# EAGLE design kinesisBLE V5 (EAGLE 9.5.2)
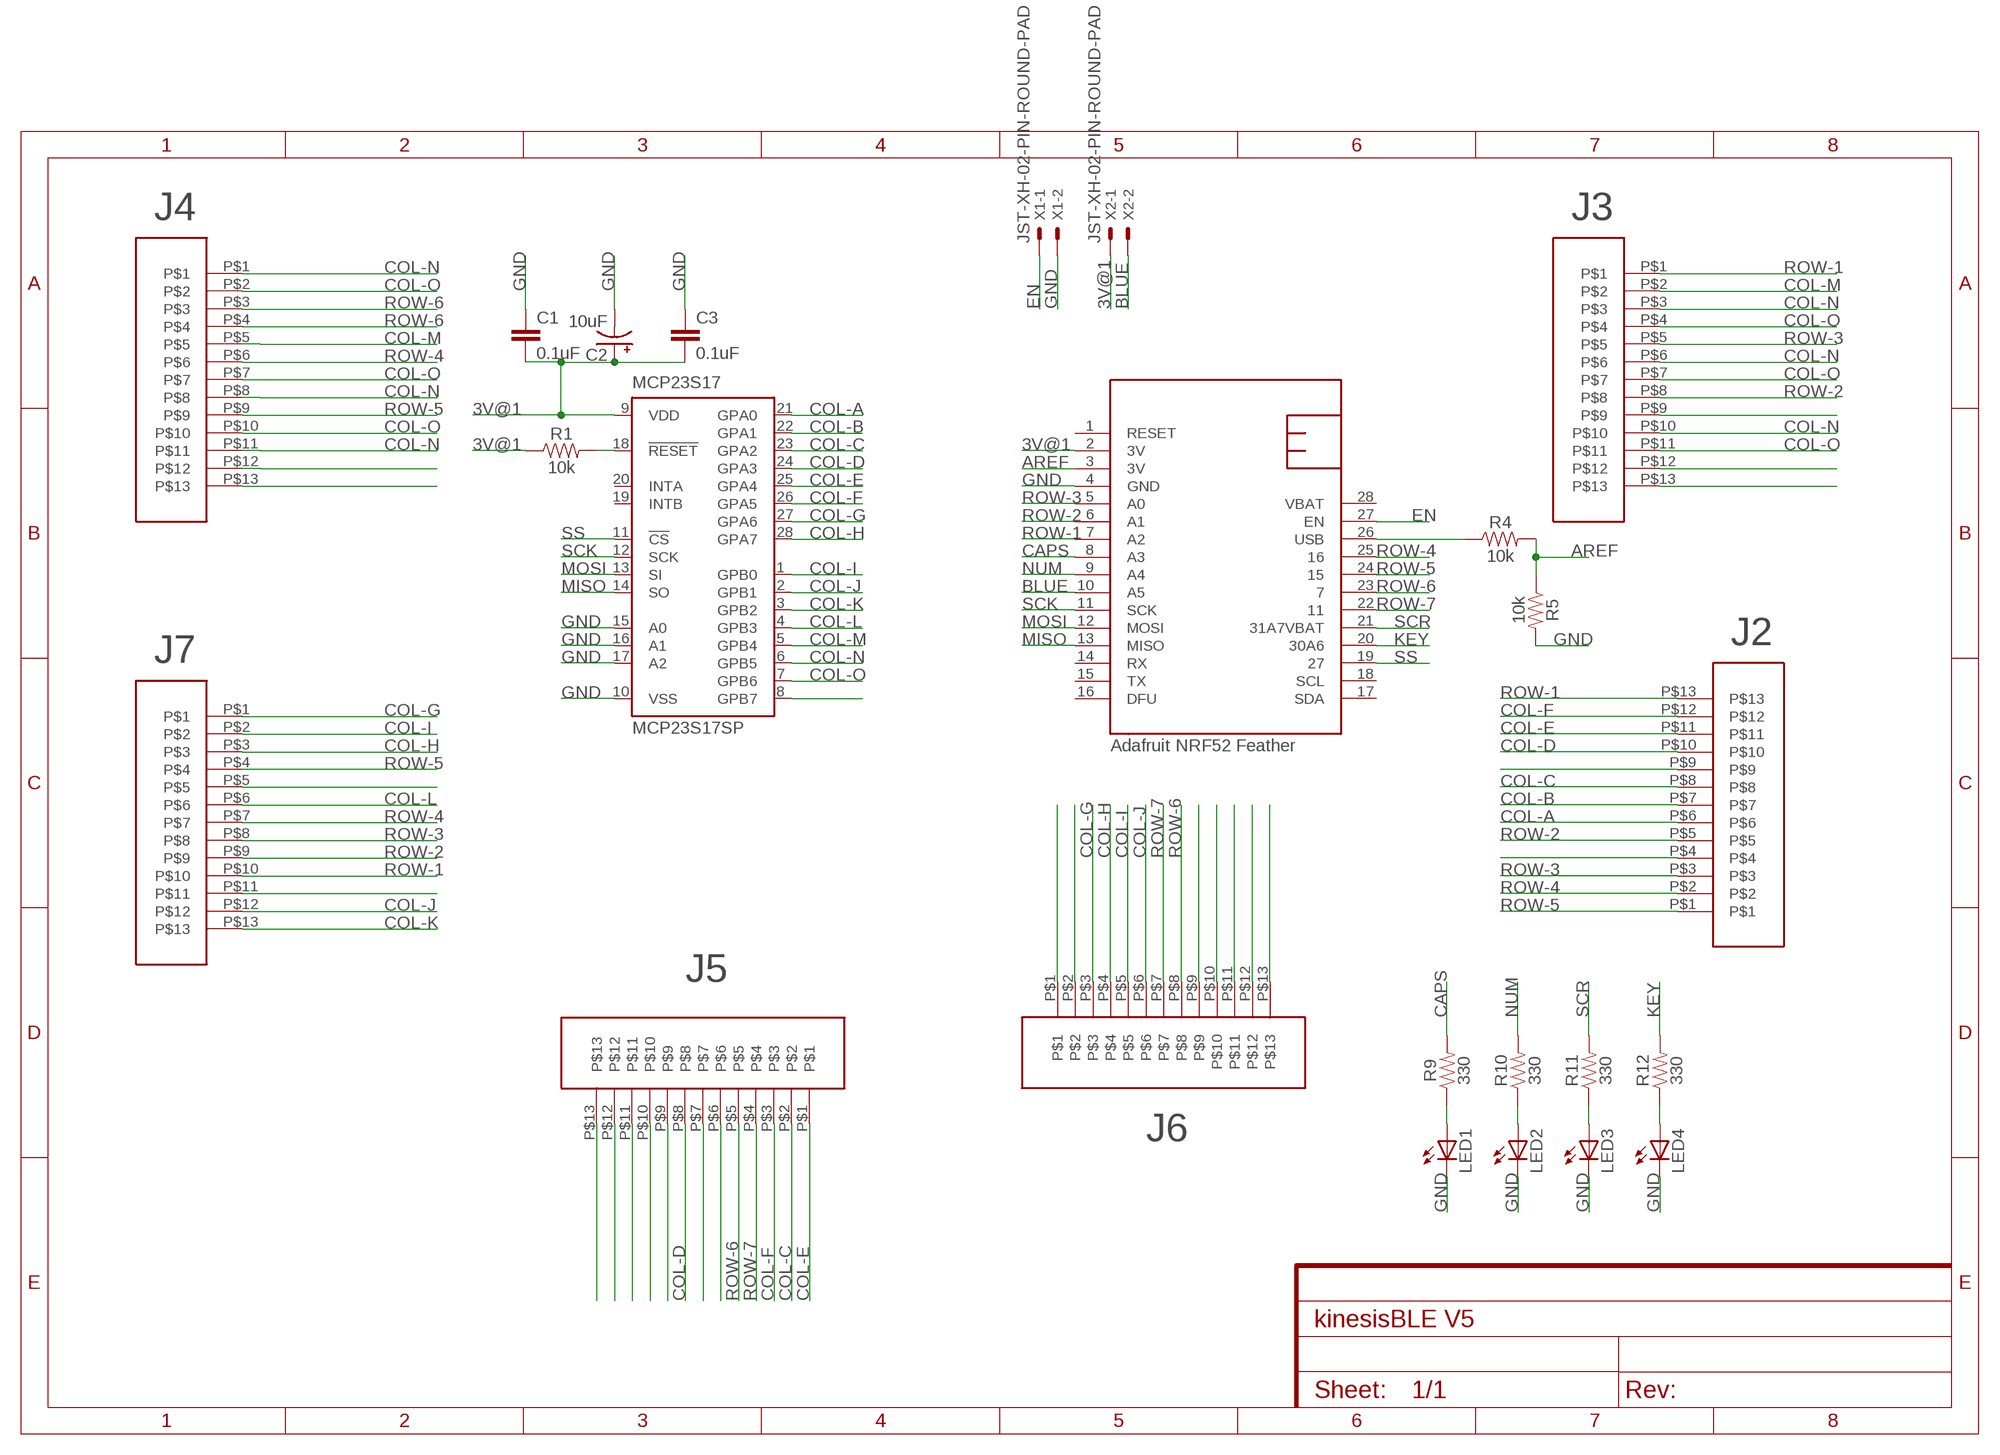
[diagram p0: schematic, sheet 1]

## Parts
C1  0.1uF  0.1UF-KIT-EZ-50V-20%  [CAP-PTH-SMALL-KIT]
C2  10uF  10UF-POLAR-RADIAL-2.5MM-25V-20%  [CPOL-RADIAL-2.5MM-5MM]
C3  0.1uF  0.1UF-KIT-EZ-50V-20%  [CAP-PTH-SMALL-KIT]
LED1  LED3MM  [LED3MM]
LED2  LED3MM  [LED3MM]
LED3  LED3MM  [LED3MM]
LED4  LED3MM  [LED3MM]
MCP23S17  MCP23S17SP  [DIL28-3]
R1  10k  10KOHM-HORIZ-1/4W-5%  [AXIAL-0.3]
R4  10k  10KOHM-HORIZ-1/4W-5%  [AXIAL-0.3]
R5  10k  10KOHM-HORIZ-1/4W-5%  [AXIAL-0.3]
R9  330  330OHM-HORIZ-1/10W-5%  [AXIAL-0.3]
R10  330  330OHM-HORIZ-1/10W-5%  [AXIAL-0.3]
R11  330  330OHM-HORIZ-1/10W-5%  [AXIAL-0.3]
R12  330  330OHM-HORIZ-1/10W-5%  [AXIAL-0.3]
U$1  NRF52FEATHER  [NRF52FEATHER]
U$2  TOPLINKS_STAPELBERG  [TOPLINKS_STAPELBERG]
U$3  TOPLINKS_STAPELBERG  [TOPLINKS_STAPELBERG]
U$4  TOPLINKS_STAPELBERG  [TOPLINKS_STAPELBERG]
U$5  TOPLINKS_STAPELBERG  [TOPLINKS_STAPELBERG]
U$6  TOPLINKS_STAPELBERG  [TOPLINKS_STAPELBERG]
U$7  TOPLINKS_STAPELBERG  [TOPLINKS_STAPELBERG]
X1  JST-XH-02-PIN-ROUND-PAD  [JST-XH-02-PACKAGE-ROUND-PAD]
X2  JST-XH-02-PIN-ROUND-PAD  [JST-XH-02-PACKAGE-ROUND-PAD]

## Nets
3V@1: C1.2 C2.1(+) C3.2 MCP23S17.9(VDD) R1.P$1 U$1.2(3V) X2.1
AREF: R4.P$2 R5.P$1 U$1.3(3V)
BLUE: U$1.10(A5) X2.2
CAPS: R9.P$2 U$1.8(A3)
COL-A: MCP23S17.21(GPA0) U$5.P$6
COL-B: MCP23S17.22(GPA1) U$5.P$7
COL-C: MCP23S17.23(GPA2) U$5.P$8 U$6.P$2
COL-D: MCP23S17.24(GPA3) U$5.P$10 U$6.P$8
COL-E: MCP23S17.25(GPA4) U$5.P$11 U$6.P$1
COL-F: MCP23S17.26(GPA5) U$5.P$12 U$6.P$3
COL-G: MCP23S17.27(GPA6) U$4.P$1 U$7.P$3
COL-H: MCP23S17.28(GPA7) U$4.P$3 U$7.P$4
COL-I: MCP23S17.1(GPB0) U$4.P$2 U$7.P$5
COL-J: MCP23S17.2(GPB1) U$4.P$12 U$7.P$6
COL-K: MCP23S17.3(GPB2) U$4.P$13
COL-L: MCP23S17.4(GPB3) U$4.P$6
COL-M: MCP23S17.5(GPB4) U$2.P$5 U$3.P$2
COL-N: MCP23S17.6(GPB5) U$2.P$1 U$2.P$8 U$2.P$11 U$3.P$3 U$3.P$6 U$3.P$10
COL-O: MCP23S17.7(GPB6) U$2.P$2 U$2.P$7 U$2.P$10 U$3.P$4 U$3.P$7 U$3.P$11
EN: U$1.27(EN) X1.1
GND: C1.1 C2.2(-) C3.1 LED1.K(C) LED2.K(C) LED3.K(C) LED4.K(C) MCP23S17.10(VSS) MCP23S17.15(A0) MCP23S17.16(A1) MCP23S17.17(A2) R5.P$2 U$1.4(GND) X1.2
KEY: R12.P$2 U$1.20(30A6)
MISO: MCP23S17.14(SO) U$1.13(MISO)
MOSI: MCP23S17.13(SI) U$1.12(MOSI)
N$1: LED1.A R9.P$1
N$2: U$3.P$13
N$3: U$3.P$12
N$4: MCP23S17.18(!RESET) R1.P$2
N$5: R4.P$1 U$1.26(USB)
N$6: U$3.P$9
N$10: LED2.A R10.P$1
N$11: LED3.A R11.P$1
N$12: LED4.A R12.P$1
N$19: U$5.P$9
N$21: MCP23S17.8(GPB7)
N$24: U$5.P$4
N$39: U$2.P$12
N$40: U$2.P$13
N$44: U$4.P$5
N$50: U$4.P$11
N$54: U$6.P$13
N$55: U$6.P$11
N$56: U$6.P$12
N$57: U$6.P$10
N$58: U$6.P$9
N$60: U$6.P$7
N$61: U$6.P$6
N$67: U$7.P$1
N$68: U$7.P$2
N$75: U$7.P$9
N$76: U$7.P$10
N$77: U$7.P$11
N$78: U$7.P$12
N$79: U$7.P$13
NUM: R10.P$2 U$1.9(A4)
ROW-1: U$1.7(A2) U$3.P$1 U$4.P$10 U$5.P$13
ROW-2: U$1.6(A1) U$3.P$8 U$4.P$9 U$5.P$5
ROW-3: U$1.5(A0) U$3.P$5 U$4.P$8 U$5.P$3
ROW-4: U$1.25 U$2.P$6 U$4.P$7 U$5.P$2
ROW-5: U$1.24 U$2.P$9 U$4.P$4 U$5.P$1
ROW-6: U$1.23 U$2.P$3 U$2.P$4 U$6.P$5 U$7.P$8
ROW-7: U$1.22 U$6.P$4 U$7.P$7
SCK: MCP23S17.12(SCK) U$1.11(SCK)
SCR: R11.P$2 U$1.21(31A7VBAT)
SS: MCP23S17.11(!CS) U$1.19
Unconnected: MCP23S17.19(INTB) MCP23S17.20(INTA) U$1.1(RESET) U$1.14(RX) U$1.15(TX) U$1.16(DFU) U$1.17(SDA) U$1.18(SCL)

## Notes on the sheet
- J4 | J3
- J2
- J7
- Adafruit NRF52 Feather
- J5
- J6

## Power pins joined to a net without a drawn wire
VBAT: U$1.28(VBAT)

## Library data of the parts
C1 C3 = SparkFun-Capacitors:0.1UF: 0.1µF ceramic capacitors A capacitor is a passive two-terminal electrical component used to store electrical energy temporarily in an electric field.; PROD_ID: CAP-08370
C2 = SparkFun-Capacitors:10UF-POLAR: 10.0µF polarized capacitors A capacitor is a passive two-terminal electrical component used to store electrical energy temporarily in an electric field.; PROD_ID: CAP-08440
LED1-LED4 = adafruit:LED: LED OSRAM: - CHIPLED LG R971, LG N971, LY N971, LG Q971, LY Q971, LO R971, LY R971 LH N974, LH R974 LS Q976, LO Q976, LY Q976 LO Q996 - Hyper CHIPLED LW Q18S LB Q993, LB Q99A, LB R99A - SideLED LS A670, LO A670, LY A670, LG A670, LP A670 LB A673, LV A673, LT A673, LW A673 LH A674 LY A675 LS A676, LA A676, LO A676, LY A676, LW A676 LS A679, LY A679, LG A679 - Hyper Micro SIDELED® LS Y876, LA Y876, LO Y876, LY Y876 LT Y87S - SmartLED LW L88C, LW L88S LB L89C, LB L89S, LG L890 LS L89K, LO L89K, LY L89K LS L896, LA L896, LO L896, LY L896 - TOPLED LS T670, LO T670, LY T670, LG T670, LP T670 LSG T670, LSP T670, LSY T670, LOP T670, LYG T670 LG T671, LOG T671, LSG T671 LB T673, LV T673, LT T673, LW T673 LH T674 LS T676, LA T676, LO T676, LY T676, LB T676, LH T676, LSB T676, LW T676 LB T67C, LV T67C, LT T67C, LS T67K, LO T67K, LY T67K, LW E67C LS E67B, LA E67B, LO E67B, LY E67B, LB E67C, LV E67C, LT E67C LW T67C LS T679, LY T679, LG T679 LS T770, LO T770, LY T770, LG T770, LP T770 LB T773, LV T773, LT T773, LW T773 LH T774 LS E675, LA E675, LY E675, LS T675 LS T776, LA T776, LO T776, LY T776, LB T776 LHGB T686 LT T68C, LB T68C - Hyper Mini TOPLED® LB M676 - Mini TOPLED Santana® LG M470 LS M47K, LO M47K, LY M47K Source: http://www.osram.convergy.de/
MCP23S17 = microchip:MCP23S17: http://ww1.microchip.com/downloads/en/DeviceDoc/21952a.pdf Source: http://ww1.microchip.com/downloads/en/DeviceDoc/21952a.pdf; MF: MICROCHIP; MPN: MCP23S17-E/SP; OC_FARNELL: 1292238; OC_NEWARK: 31K2951
R1 R4 R5 = SparkFun-Resistors:10KOHM: 10kΩ resistor A resistor is a passive two-terminal electrical component that implements electrical resistance as a circuit element. Resistors act to reduce current flow, and, at the same time, act to lower voltage levels within circuits. - Wikipedia; PROD_ID: RES-09435
R9-R12 = SparkFun-Resistors:330OHM: 330Ω resistor A resistor is a passive two-terminal electrical component that implements electrical resistance as a circuit element. Resistors act to reduce current flow, and, at the same time, act to lower voltage levels within circuits. - Wikipedia; PROD_ID: RES-8371
U$1 = mike:NRF52FEATHER
U$2-U$7 = con-molex-39-53:TOPLINKS_STAPELBERG
X1 X2 = Rembrandt Electronics - JST XH Connectors v1-0:JST-XH-02-PIN: JST XH Connector 2 Pin Wire to board connector. Pitch: 2,54 mm, (0.100") Number of pins: 2 Created by Rembrandt Electronics www.rembrandtelectronics.com

## Board
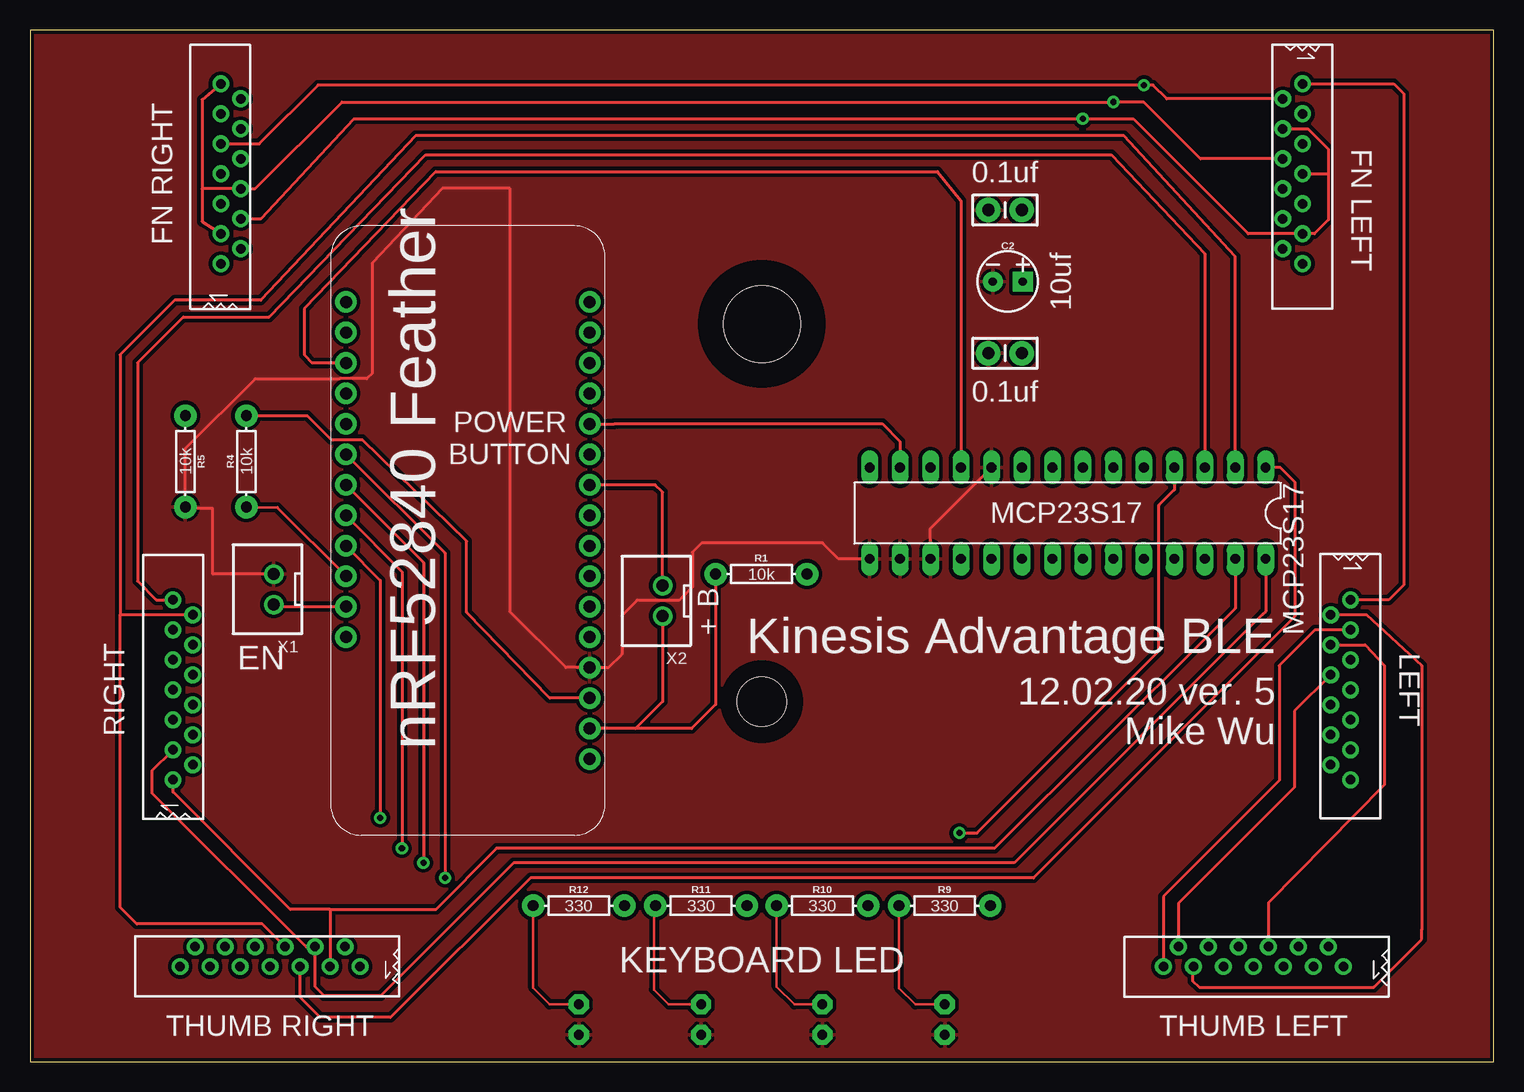
[diagram p1: board, top side]
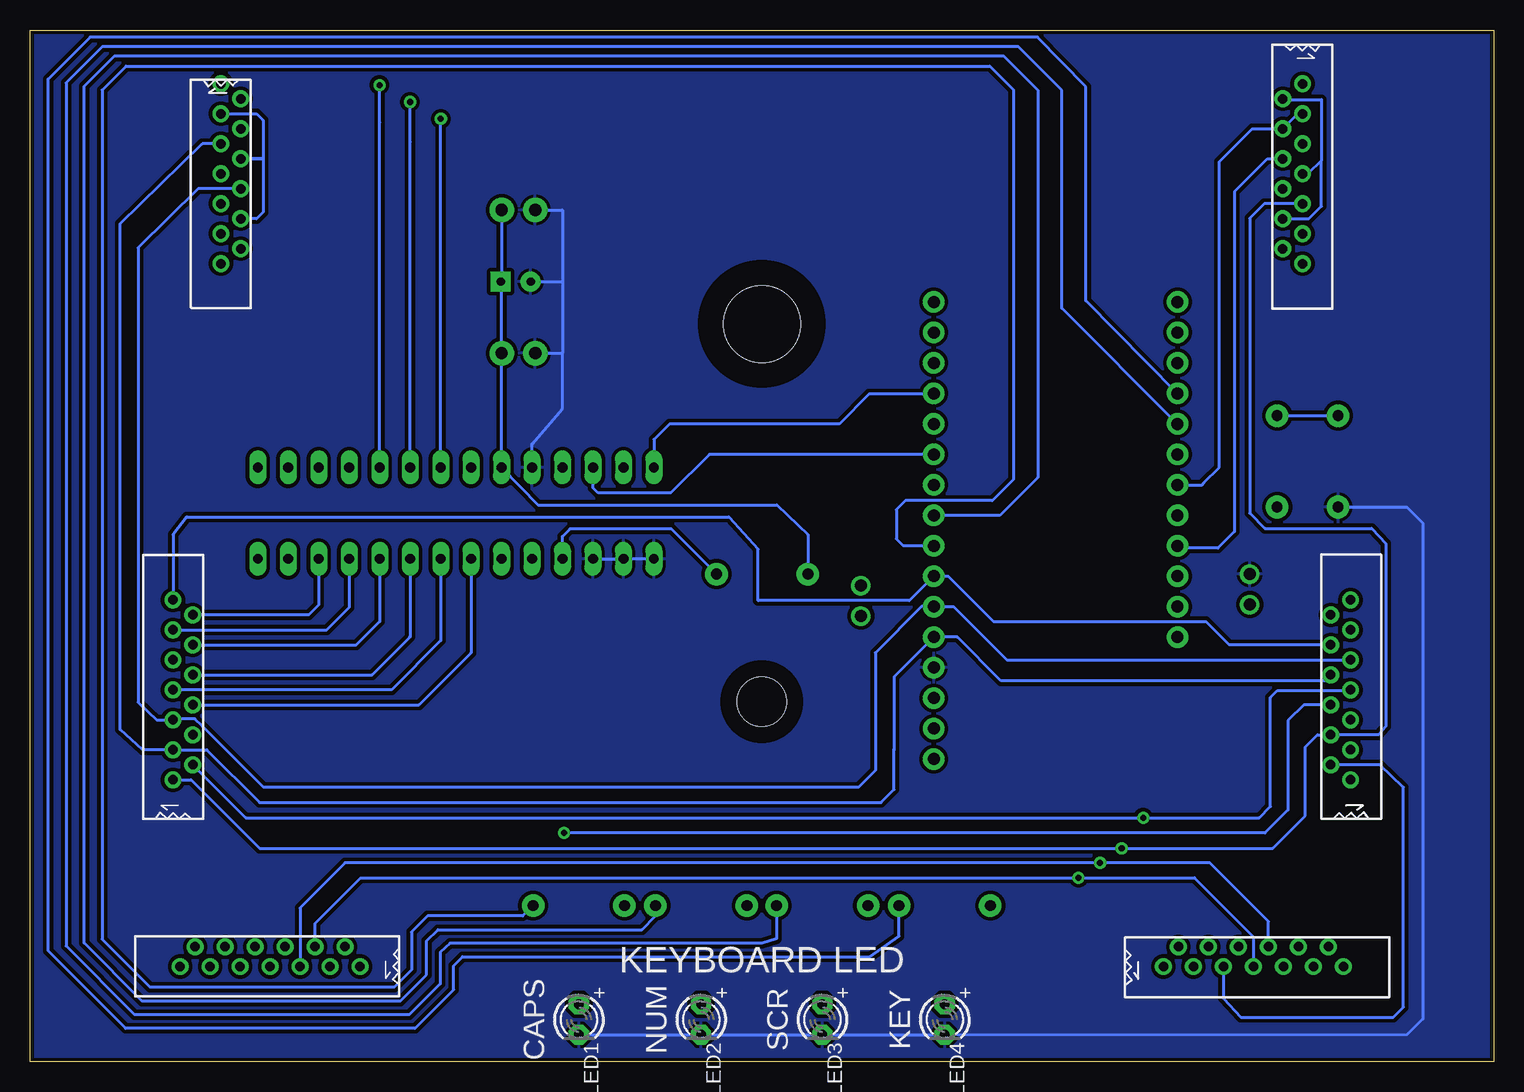
[diagram p2: board, bottom side, seen from below]

Size 122 x 86 mm. Coordinates in mm from the lower left corner, seen from the top.
Outline: 0,0 122,0 122,86 0,86 0,0
Copper layers (1*16): Top 0.035mm / dielectric 1.5mm / Bottom 0.035mm
Design rules "SparkFun": minimum track width 8mil, minimum drill 20mil, track to track 8mil, track to pad 8mil, pad to pad 8mil, via to via 8mil, smd to smd 8mil, copper to edge 8mil, drill to drill 8mil, minimum pad ring 12mil, minimum via ring 10mil, stop-mask expansion 4mil, vias tented up to drill 20mil, thermal gap 10mil
Holes 6.4 mm at 61,61.5
Holes 4.1 mm at 61,30
tKeepout: area 56,56.5 to 66,66.5; area 58.4,27.4 to 63.6,32.6
bKeepout: area 56,56.5 to 66,66.5; area 58.4,27.4 to 63.6,32.6
tRestrict: area 56,56.5 to 66,66.5; area 58.4,27.4 to 63.6,32.6
bRestrict: area 56,56.5 to 66,66.5; area 58.4,27.4 to 63.6,32.6
vRestrict: area 56,56.5 to 66,66.5; area 58.4,27.4 to 63.6,32.6

### Footprints (pad centres in the part's own frame; a part is rotated, then mirrored left to right if it is on the bottom)
CAP-PTH-SMALL-KIT = drill 1.016 pad 2.032: 1 -1.397,0; 2 1.397,0
CPOL-RADIAL-2.5MM-5MM = drill 0.7 pad 1.651 square: 1 1.25,0 | drill 0.7 pad 1.651: 2 -1.25,0
LED3MM = drill 0.813 pad 1.676 octagon: A -1.27,0; K 1.27,0
DIL28-3 = drill 0.813 long: 1 -16.51,-3.81; 2 -13.97,-3.81; 3 -11.43,-3.81; 4 -8.89,-3.81; 5 -6.35,-3.81; 6 -3.81,-3.81; 7 -1.27,-3.81; 8 1.27,-3.81; 9 3.81,-3.81; 10 6.35,-3.81; 11 8.89,-3.81; 12 11.43,-3.81; 13 13.97,-3.81; 14 16.51,-3.81; 15 16.51,3.81; 16 13.97,3.81; 17 11.43,3.81; 18 8.89,3.81; 19 6.35,3.81; 20 3.81,3.81; 21 1.27,3.81; 22 -1.27,3.81; 23 -3.81,3.81; 24 -6.35,3.81; 25 -8.89,3.81; 26 -11.43,3.81; 27 -13.97,3.81; 28 -16.51,3.81
AXIAL-0.3 = drill 0.9 pad 1.88: P$1 -3.81,0; P$2 3.81,0
NRF52FEATHER = drill 1 pad 1.778: 1 -17.78,-10.16; 2 -15.24,-10.16; 3 -12.7,-10.16; 4 -10.16,-10.16; 5 -7.62,-10.16; 6 -5.08,-10.16; 7 -2.54,-10.16; 8 0,-10.16; 9 2.54,-10.16; 10 5.08,-10.16; 11 7.62,-10.16; 12 10.16,-10.16; 13 12.7,-10.16; 14 15.24,-10.16; 15 17.78,-10.16; 16 20.32,-10.16; 17 20.32,10.16; 18 17.78,10.16; 19 15.24,10.16; 20 12.7,10.16; 21 10.16,10.16; 22 7.62,10.16; 23 5.08,10.16; 24 2.54,10.16; 25 0,10.16; 26 -2.54,10.16; 27 -5.08,10.16; 28 -7.62,10.16
TOPLINKS_STAPELBERG = drill 0.8: P$1 -0.08,7.51; P$2 1.57,6.26; P$3 -0.08,5.01; P$4 1.57,3.76; P$5 -0.08,2.51; P$6 1.57,1.26; P$7 -0.08,0.01; P$8 1.57,-1.24; P$9 -0.08,-2.49; P$10 1.57,-3.74; P$11 -0.08,-4.99; P$12 1.57,-6.24; P$13 -0.08,-7.49
JST-XH-02-PACKAGE-ROUND-PAD = drill 1.016: 1 -1.27,0; 2 1.27,0

### Placement (x,y rotation side)
C1  81.28,59.05 0 top
C2  81.51,65.02 0 top
C3  81.28,70.99 0 top
LED1  76.25,3.5 270 bottom
LED2  66.05,3.5 270 bottom
LED3  55.95,3.5 270 bottom
LED4  45.75,3.5 270 bottom
MCP23S17  86.5,45.72 180 top
R1  60.96,40.64 0 top
R4  18.03,50.04 90 top
R5  12.95,50.04 270 top
R9  76.25,13 0 top
R10  66.05,13 0 top
R11  55.95,13 0 top
R12  45.75,13 0 top
U$1  36.5,43 90 top
U$2  16,74 0 top
U$3  106,74 0 bottom
U$4  12,31 180 bottom
U$5  110,31 180 top
U$6  102,8 90 top
U$7  20,8 90 bottom
X1  20.32,39.37 90 top
X2  52.73,38.4 90 top

### Tracks (layer width: path | path; a pad name or v marks a point on that pad's centre or on a via)
3V@1
  Top 0.254: R1.P$1 57.15,29.76 55.15,27.76 50.47,27.76 | 50.47,27.76 U$1.2 | X2.1 52.73,30.02 50.47,27.76
  Bottom 0.245: C3.2 82.68,64.92
  Bottom 0.254: C2.1 82.68,64.92 C1.2 MCP23S17.9 79.66,46.4 59.73,46.4 57.15,43.94 R1.P$1
AREF
  Top 0.254: R4.P$2 23.11,53.85 25.12,51.84 27.7,51.84 36.4,43.38 36.4,37.45 43.32,30.3 U$1.3
  Bottom 0.254: R4.P$2 R5.P$1
BLUE
  Top 0.254: X2.2 52.73,47.46 52.11,48.08 U$1.10
CAPS
  Bottom 0.254: R9.P$2 80.93,12.13 88.87,12.13 90.2,10.8 90.2,7.64 91.64,6.2 112,6.2 116,10.2 116,81 114,83 42,83 40.01,81.01 40.01,48.53 41.78,46.76 49.03,46.76 49.78,46.01 49.78,43.58 49.2,43 U$1.8
COL-A
  Bottom 0.254: U$5.P$6 89.56,29.74 85.23,34.07 MCP23S17.21
COL-B
  Bottom 0.254: U$5.P$7 91.87,30.99 87.77,35.09 MCP23S17.22
COL-C
  Top 0.254: U$5.P$8 105.41,29.22 105.41,22.86 95.74,13.19 U$6.P$2
  Bottom 0.254: U$5.P$8 93.49,32.24 90.36,35.37 | 90.36,35.37 90.31,35.42 | MCP23S17.23 90.31,35.42 | 90.31,35.42 90.36,35.37
COL-D
  Top 0.254: U$5.P$10 111.31,34.74 112.9,33.02 112.9,23.07 103.24,13.24 U$6.P$8
  Bottom 0.254: U$5.P$10 94.8,34.74 92.85,36.69 MCP23S17.24
COL-E
  Top 0.254: U$6.P$1 94.49,13.77 104.14,23.42 104.14,33.02 107.11,35.99 U$5.P$11
  Bottom 0.254: U$5.P$11 97.26,35.99 95.38,37.87 95.39,37.88 MCP23S17.25
COL-F
  Top 0.254: 116,11 116,33.01 111.41,37.25 108.44,37.25 U$5.P$12 | U$6.P$3 96.94,7.87 96.94,6.68 97.47,6.2 112,6.2 116,10.2 | 116,10.2 116,11 | 116,10.2 116,11
  Bottom 0.254: U$5.P$12 98.76,37.24 97.93,38.07 MCP23S17.26
COL-G
  Top 0.203: U$7.P$3 | 33.83,12.68 33.86,12.7
  Top 0.254: U$4.P$1 11.92,22.46 21.7,12.68 25.01,12.68 | 33.86,12.7 38.89,17.78 80.42,17.78 98.34,35.66 100.47,37.79 MCP23S17.27 | 25.01,12.68 U$7.P$3 | 25.01,12.68 33.83,12.68
COL-H
  Top 0.254: U$4.P$3 10.16,24.23 10.16,22.41 23,9.57 U$7.P$4 23.76,6.24 24.51,5.49 29.23,5.49 40.32,16.57 82.05,16.57 102.74,37.26 103.01,37.53 MCP23S17.28
COL-I
  Top 0.254: U$7.P$5 22.52,7.91 22.52,5.33 24.17,3.68 30.05,3.68 41.71,15.31 83.66,15.31 105.43,37.11 105.43,48.32 104.22,49.53 MCP23S17.1
  Bottom 0.254: U$7.P$5 22.51,5.27 21.05,3.68 8.37,3.68 7.52,4.54 7.52,22.86 9.5,24.74 U$4.P$2
COL-J
  Top 0.254: 7.52,37.24 7.52,58.93 12.06,63.47 19.24,63.47 32.15,77.2 91.19,77.2 100.47,67.12 MCP23S17.2 | U$4.P$12 7.52,37.24 | 7.52,37.24 7.52,12.86 8.91,11.47 19.36,11.47 U$7.P$6
COL-K
  Top 0.254: U$4.P$13 10.53,38.49 8.97,40.06 8.97,58.25 12.68,61.97 12.79,62.08 19.92,62.08 32.98,75.6 90.13,75.6 97.93,67.34 MCP23S17.3
COL-L  (via drill 0.51)
  Top 0.254: 95.36,47.64 94.11,46.38 94.11,34.21 78.95,19.05 v77.47,19.05 | 95.36,47.64 95.39,47.66 | MCP23S17.4 95.39,47.66 | 95.39,47.66 95.36,47.64
  Bottom 0.254: U$4.P$6 15.81,29.74 17.13,28.42 17.13,20.97 19.05,19.05 v77.47,19.05
COL-M  (via drill 0.51)
  Top 0.254: U$3.P$2 94.75,80.26 93.61,81.4 v92.86,81.4 24,81.4 19.11,76.51 U$2.P$5
  Bottom 0.254: MCP23S17.5 92.85,78.29 v92.86,81.4
COL-N  (via drill 0.51)
  Top 0.254: U$2.P$1 14.35,80.2 14.35,72.76 | 14.35,72.76 14.35,70.04 U$2.P$11 | 14.35,72.76 U$2.P$8 18.76,72.76 26,80 v90.32,80 92.84,80 97.58,75.26 U$3.P$6
  Bottom 0.254: U$3.P$3 103.11,79.01 102.57,78.47 102.57,75.26 U$3.P$6 102.57,75.26 102.57,70.8 103.11,70.26 U$3.P$10 | MCP23S17.6 90.31,76.67 v90.32,80
COL-O  (via drill 0.51)
  Top 0.254: U$3.P$4 106.54,77.76 108.25,76.05 108.25,74.04 | 108.25,74.04 108.25,70.18 107.08,69.01 U$3.P$11 101.56,69.01 91.97,78.6 v87.76,78.6 27,78.6 19.26,70.26 U$2.P$10 | U$3.P$7 108.21,74.01 108.25,74.04
  Bottom 0.254: U$2.P$2 17.51,80.2 14.35,80.2 14.35,75.12 | 14.35,75.12 15.46,74.01 U$2.P$7 | U$2.P$10 15.4,70.26 14.35,71.31 14.35,75.12 | MCP23S17.7 87.77,78.59 v87.76,78.6
EN
  Top 0.254: X1.1 20.5,37.92 U$1.27
GND
  Top 0.254: X1.2 15.24,40.64 15.21,40.67 15.21,46.14 13.05,46.14 R5.P$2 12.95,51.11 18.75,56.91 25.83,56.91 25.84,56.92 28.08,56.92 28.53,57.37 28.53,66.58 34.39,72.8 40.01,72.8 40.01,37.5 44.67,32.84 U$1.4 48.23,32.84 49.34,33.95 49.34,37.18 50.6,38.44 54.1,38.44 55.21,39.55 55.21,42.46 55.99,43.24 66.08,43.24 67.41,41.91 MCP23S17.15 | MCP23S17.17 75.07,44.45 MCP23S17.10
  Bottom 0.203: LED4.K 7.22,2.23
  Bottom 0.254: 77.61,59.08 77.61,54.45 80.16,51.49 80.15,51.47 MCP23S17.10 | C1.1 77.61,59.08 | R5.P$2 7.23,46.23 5.89,44.89 5.89,3.56 7.22,2.23 | LED1.K LED2.K LED3.K LED4.K | MCP23S17.17 MCP23S17.16 MCP23S17.15 | C3.1 77.61,70.99 77.61,65.02 | C2.2 77.61,65.02 | 77.61,65.02 77.61,59.08
  pour Top (isolate 0.305): 0,86 122,86 122,0 121.92,0 0,0
  pour Bottom (isolate 0.305): 0,86 122,86 122,0 0,0
KEY
  Bottom 0.254: R12.P$2 49.56,10.44 52,8.74 85.94,8.74 86.68,8 86.68,6 89.91,2.77 114.04,2.77 120.5,9.23 120.5,81.9 117,85.4 38.02,85.4 34,81.27 34,63.43 U$1.20
MISO
  Bottom 0.254: U$1.13 46.7,55.66 52.05,55.66 54.54,53.16 68.69,53.16 69.99,51.86 MCP23S17.14
MOSI
  Top 0.254: MCP23S17.13 72.53,51.69 71.04,53.17 48.69,53.17 48.7,53.16 U$1.12
N$1
  Top 0.203: LED1.A 73.79,4.77 72.44,6.12 R9.P$1
N$4
  Bottom 0.254: R1.P$2 68.53,44.4 77,44.4 77.61,43.79 MCP23S17.18
N$5
  Top 0.254: R4.P$1 20.61,46.19 U$1.26
N$10
  Top 0.203: LED2.A 63.71,4.77 62.24,6.24 R10.P$1
N$11
  Top 0.203: R11.P$1 52,12.86 52,6 53.23,4.77 LED3.A
N$12
  Top 0.203: LED4.A 43.31,4.77 41.94,6.14 R12.P$1
NUM
  Bottom 0.254: R10.P$2 69.86,12.14 71,11 88,11 88.94,10.06 88.94,7.25 91.15,5.03 112.65,5.03 117.5,9.88 117.5,81.3 115,83.8 40.8,83.8 38,81 38,48.7 41.16,45.54 U$1.9
ROW-1
  Top 0.254: U$3.P$1 113.68,81.51 114.5,80.69 114.5,39.72 113.27,38.49 U$5.P$13
  Bottom 0.254: U$4.P$10 22.04,34.74 23.98,36.68 41.68,36.68 45.46,40.46 U$1.7 48.69,38.43 61.31,38.43 61.31,42.71 63.73,45.4 108.93,45.4 110.08,43.92 U$5.P$13
ROW-2
  Bottom 0.254: 110.49,28.49 111.44,28.49 113,29.96 113,67.84 108,72.76 U$3.P$8 | 110.49,28.49 U$5.P$5 | 110.49,28.49 110.41,28.57 108.26,28.57 107.62,27.93 107.62,27.94 102.54,22.86 52.93,22.86 51.53,24.26 51.53,34.07 47.68,37.92 U$1.6 45,37.92 40.57,33.49 U$4.P$9
ROW-3
  Bottom 0.254: U$3.P$5 107.64,76.51 114.5,69.85 114.5,27.67 112.62,25.99 U$5.P$3 107.27,25.99 102.87,21.59 51.06,21.59 49.97,22.68 49.97,25.96 49.97,26.06 49.97,32.07 U$1.5 44.69,35.38 41.06,31.75 14.06,31.75 U$4.P$8
ROW-4  (via drill 0.51)
  Top 0.254: U$1.25 29.2,40.1 v29.2,20.32
  Bottom 0.254: U$2.P$6 18.84,75.26 21.59,72.51 21.59,44.17 22.96,42.8 22.96,42.82 26.16,42.82 U$1.25 | U$5.P$2 104.01,20.32 v29.2,20.32 19.53,20.32 18.59,21.26 18.59,30.35 18,30.94 11.97,30.94 U$4.P$7
ROW-5  (via drill 0.51)
  Top 0.254: U$1.24 31,40.82 v31,17.78
  Bottom 0.254: U$2.P$9 19.12,71.51 20.32,70.31 20.32,45.72 19.05,44.45 10.16,44.45 8.97,43.18 8.97,27.94 9.59,27.24 U$4.P$4 14.67,27.24 15.7,26.21 15.7,20.5 18.41,17.78 v31,17.78 102.87,17.78 108.58,23.49 U$5.P$1
ROW-6  (via drill 0.51)
  Top 0.203: 32.8,16.59 v32.8,16.57
  Top 0.254: U$1.23 32.8,41.6 32.8,16.59
  Bottom 0.254: U$7.P$8 18.76,11.68 23.64,16.56 v32.8,16.57 95.74,16.57 99.5,12.8 U$6.P$5 | U$1.23 24.31,48.08 24.13,48.26 22.86,49.53 22.86,75.01 20.11,77.76 U$2.P$4 16.32,79.01 U$2.P$3
ROW-7  (via drill 0.51)
  Top 0.254: U$1.22 34.6,42.39 v34.6,15.32
  Bottom 0.254: U$6.P$4 98.24,11.52 94.44,15.31 v34.6,15.32 24.94,15.32 20.01,10.39 U$7.P$7
SCK
  Bottom 0.254: MCP23S17.12 75.07,47.83 74.63,47.4 68.59,47.4 65.37,50.62 U$1.11
SCR
  Bottom 0.254: R11.P$2 59.76,10.24 61,9.87 86.99,9.87 87.81,9.12 87.81,6.47 90.38,3.9 113.27,3.9 119,9.63 119,81.6 116,84.6 39.59,84.6 36,80.97 36,62.79 U$1.21
SS
  Top 0.254: MCP23S17.11 77.61,71.77 75.66,74.2 33.82,74.2 22.86,62.75 22.86,58.92 23.54,58.24 U$1.19

### Text on the board
tPlace: FN RIGHT | 0.1uf | FN LEFT | 10uf | 0.1uf | POWER / BUTTON | 10k | 10k | MCP23S17 | 10k | B | + | EN | Kinesis Advantage BLE | RIGHT | LEFT | 12.02.20 ver. 5 | nRF52840 Feather | Mike Wu | 330 | 330 | 330 | 330 | KEYBOARD LED | THUMB RIGHT | THUMB LEFT
bPlace: KEYBOARD LED | KEY | SCR | NUM | CAPS